# Altium schematic sheet Daemons.SchDoc
size B; DocumentNumber: 1; SheetNumber: 1; SheetTotal: 1
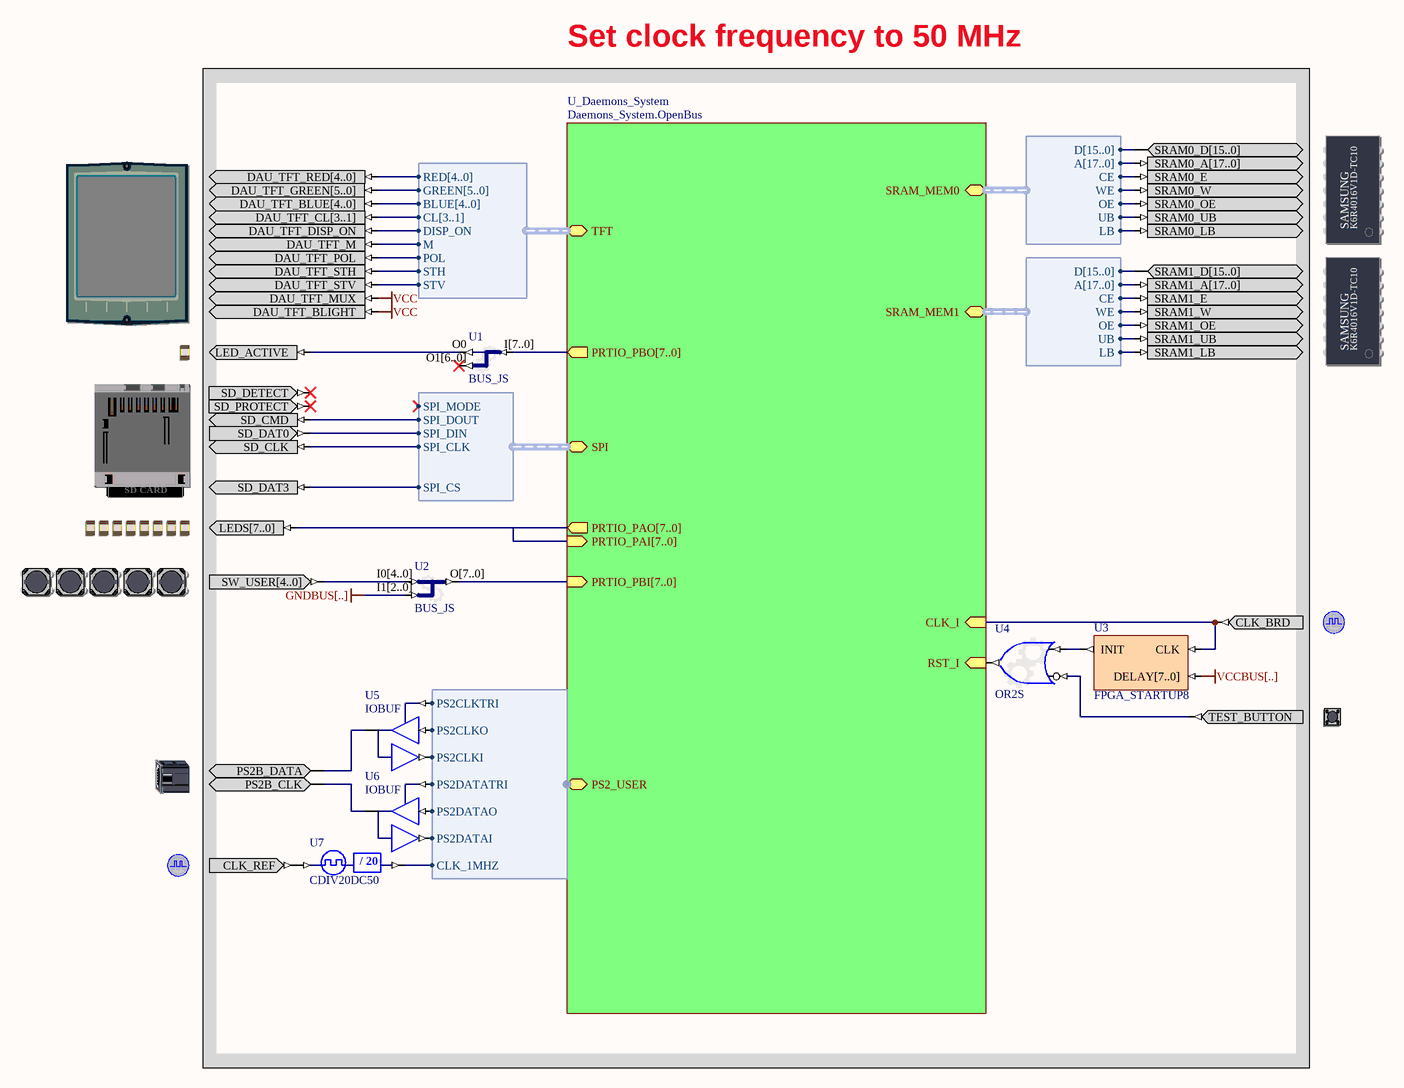
[diagram p0: Daemons.SchDoc]

## Parts
(Parts that share a designator on the sheet are numbered #1, #2 ... from top to bottom, then left to right.)
?#1  SRAM_DAUGHTER0  (value not drawn)
?#2  TFT_LCD  (value not drawn)
?#3  SRAM_DAUGHTER1  (value not drawn)
?#4  LED_ACTIVE  (value not drawn)
?#5  SD_CARD  (value not drawn)
?#6  LED  (value not drawn)
?#7  USER_BUTTONS  (value not drawn)
?#8  CLOCK_BOARD  (value not drawn)
?#9  TEST_BUTTON  (value not drawn)
?#10  PS2B  (value not drawn)
?#11  CLOCK_REFERENCE  (value not drawn)
U1  BUS_JS
U2  BUS_JS
U3  FPGA_STARTUP8
U4  OR2S
U5  IOBUF
U6  IOBUF
U7  CDIV20DC50

## Blocks framed on the sheet
Set clock frequency to 50 MHz: ?#1-?#11 U1-U7

## Sub-sheets
U_Daemons_System = Daemons_System.OpenBus: CLK_I (in), RST_I (in), PRTIO_PAO[7..0] (out), PRTIO_PAI[7..0] (in), PRTIO_PBO[7..0] (out), PRTIO_PBI[7..0] (in), TFT (harness VGA32_TFT), SPI (harness SPI_W), PS2_USER (harness PS2_W), SRAM_MEM0 (harness WB_MEM_CTRL_SRAM16_A18), SRAM_MEM1 (harness WB_MEM_CTRL_SRAM16_A18)

## Harnesses
VGA32_TFT: RED[4..0], GREEN[5..0], BLUE[4..0], CL[3..1], DISP_ON, M, POL, STH, STV
SPI_W: SPI_DOUT, SPI_DIN, SPI_CLK, SPI_MODE, SPI_CS
PS2_W: PS2CLKTRI, PS2CLKO, PS2CLKI, PS2DATATRI, PS2DATAO, PS2DATAI, CLK_1MHZ
WB_MEM_CTRL_SRAM16_A18: D[15..0], A[17..0], CE, WE, OE, UB, LB

## Nets
GNDBUS[..]: U2.I1[2..0]
VCC: ?#2.DAU_TFT_BLIGHT ?#2.DAU_TFT_MUX
VCCBUS[..]: U3.DELAY[7..0]
Net?#1_SRAM0_A[17..0]: ?#1.SRAM0_A[17..0] ; sheet U_Daemons_System/SRAM_MEM0.A[17..0]
Net?#1_SRAM0_D[15..0]: ?#1.SRAM0_D[15..0] ; sheet U_Daemons_System/SRAM_MEM0.D[15..0]
Net?#1_SRAM0_E: ?#1.SRAM0_E ; sheet U_Daemons_System/SRAM_MEM0.CE
Net?#1_SRAM0_LB: ?#1.SRAM0_LB ; sheet U_Daemons_System/SRAM_MEM0.LB
Net?#1_SRAM0_OE: ?#1.SRAM0_OE ; sheet U_Daemons_System/SRAM_MEM0.OE
Net?#1_SRAM0_UB: ?#1.SRAM0_UB ; sheet U_Daemons_System/SRAM_MEM0.UB
Net?#1_SRAM0_W: ?#1.SRAM0_W ; sheet U_Daemons_System/SRAM_MEM0.WE
Net?#2_DAU_TFT_BLUE[4..0]: ?#2.DAU_TFT_BLUE[4..0] ; sheet U_Daemons_System/TFT.BLUE[4..0]
Net?#2_DAU_TFT_CL[3..1]: ?#2.DAU_TFT_CL[3..1] ; sheet U_Daemons_System/TFT.CL[3..1]
Net?#2_DAU_TFT_DISP_ON: ?#2.DAU_TFT_DISP_ON ; sheet U_Daemons_System/TFT.DISP_ON
Net?#2_DAU_TFT_GREEN[5..0]: ?#2.DAU_TFT_GREEN[5..0] ; sheet U_Daemons_System/TFT.GREEN[5..0]
Net?#2_DAU_TFT_M: ?#2.DAU_TFT_M ; sheet U_Daemons_System/TFT.M
Net?#2_DAU_TFT_POL: ?#2.DAU_TFT_POL ; sheet U_Daemons_System/TFT.POL
Net?#2_DAU_TFT_RED[4..0]: ?#2.DAU_TFT_RED[4..0] ; sheet U_Daemons_System/TFT.RED[4..0]
Net?#2_DAU_TFT_STH: ?#2.DAU_TFT_STH ; sheet U_Daemons_System/TFT.STH
Net?#2_DAU_TFT_STV: ?#2.DAU_TFT_STV ; sheet U_Daemons_System/TFT.STV
Net?#3_SRAM1_A[17..0]: ?#3.SRAM1_A[17..0] ; sheet U_Daemons_System/SRAM_MEM1.A[17..0]
Net?#3_SRAM1_D[15..0]: ?#3.SRAM1_D[15..0] ; sheet U_Daemons_System/SRAM_MEM1.D[15..0]
Net?#3_SRAM1_E: ?#3.SRAM1_E ; sheet U_Daemons_System/SRAM_MEM1.CE
Net?#3_SRAM1_LB: ?#3.SRAM1_LB ; sheet U_Daemons_System/SRAM_MEM1.LB
Net?#3_SRAM1_OE: ?#3.SRAM1_OE ; sheet U_Daemons_System/SRAM_MEM1.OE
Net?#3_SRAM1_UB: ?#3.SRAM1_UB ; sheet U_Daemons_System/SRAM_MEM1.UB
Net?#3_SRAM1_W: ?#3.SRAM1_W ; sheet U_Daemons_System/SRAM_MEM1.WE
Net?#4_LED_ACTIVE: ?#4.LED_ACTIVE U1.O0
Net?#5_SD_CLK: ?#5.SD_CLK ; sheet U_Daemons_System/SPI.SPI_CLK
Net?#5_SD_CMD: ?#5.SD_CMD ; sheet U_Daemons_System/SPI.SPI_DOUT
Net?#5_SD_DAT0: ?#5.SD_DAT0 ; sheet U_Daemons_System/SPI.SPI_DIN
Net?#5_SD_DAT3: ?#5.SD_DAT3 ; sheet U_Daemons_System/SPI.SPI_CS
Net?#6_LEDS[7..0]: ?#6.LEDS[7..0] ; sheet U_Daemons_System/PRTIO_PAO[7..0], sheet U_Daemons_System/PRTIO_PAI[7..0]
Net?#7_SW_USER[4..0]: ?#7.SW_USER[4..0] U2.I0[4..0]
Net?#8_CLK_BRD: ?#8.CLK_BRD U3.CLK ; sheet U_Daemons_System/CLK_I
Net?#9_TEST_BUTTON: ?#9.TEST_BUTTON U4.I1
Net?#10_PS2B_CLK: ?#10.PS2B_CLK U6.IO
Net?#10_PS2B_DATA: ?#10.PS2B_DATA U5.IO
Net?#11_CLK_REF: ?#11.CLK_REF U7.CLKIN
NetU1_I[7..0]: U1.I[7..0] ; sheet U_Daemons_System/PRTIO_PBO[7..0]
NetU2_O[7..0]: U2.O[7..0] ; sheet U_Daemons_System/PRTIO_PBI[7..0]
NetU3_INIT: U3.INIT U4.I0
NetU4_O: U4.O ; sheet U_Daemons_System/RST_I
NetU5_I: U5.I ; sheet U_Daemons_System/PS2_USER.PS2CLKO
NetU5_O: U5.O ; sheet U_Daemons_System/PS2_USER.PS2CLKI
NetU5_T: U5.T ; sheet U_Daemons_System/PS2_USER.PS2CLKTRI
NetU6_I: U6.I ; sheet U_Daemons_System/PS2_USER.PS2DATAO
NetU6_O: U6.O ; sheet U_Daemons_System/PS2_USER.PS2DATAI
NetU6_T: U6.T ; sheet U_Daemons_System/PS2_USER.PS2DATATRI
NetU7_CLKDV: U7.CLKDV ; sheet U_Daemons_System/PS2_USER.CLK_1MHZ

Not connected (* = marked no-connect by the designer): ?#5 SD_DETECT* SD_PROTECT*; U1 O1[6..0]*

## Buses and harness runs
bus sheet U_Daemons_System/PRTIO_PAI[7..0] = sheet U_Daemons_System/PRTIO_PAO[7..0]

## Notes on the sheet
- Title
- Size:
- Date:
- B
- Number:
- Time:
- Revision:
- Sheet
- of
- File:
- (in symbol CDIV20DC50) / 20
- (in symbol SD_CARD) SD CARD
- (in symbol SRAM_DAUGHTER0) SAMSUNG; K6R4016V1D-TC10
- (in symbol SRAM_DAUGHTER1) SAMSUNG; K6R4016V1D-TC10

## Library data of the parts
?#1 = SRAM_DAUGHTER0: Free Static RAM - Daughterboard; PortComponent: True; Published: 14-May-2007; Publisher: Altium Limited; HelpURL: TR0143 NanoBoard Technical Reference Manual - NB2.pdf#page=24
?#2 = TFT_LCD: TFT LCD Panel; PortComponent: True; Published: 22-Jan-2007; Publisher: Altium Limited; HelpURL: TR0143 Technical Reference Manual for Altium's Desktop NanoBoard NB2DSK01.pdf#page=50
?#3 = SRAM_DAUGHTER1: Free Static RAM - Daughterboard; PortComponent: True; Published: 14-May-2007; Publisher: Altium Limited; HelpURL: TR0143 NanoBoard Technical Reference Manual - NB2.pdf#page=24
?#4 = LED_ACTIVE: LED; PortComponent: True; Published: 14-May-2007; Publisher: Altium Limited; HelpURL: TR0146 Technical Reference for Altium's Mass Storage Peripheral Board PB02.pdf#page=9
?#5 = SD_CARD: Secure Digital Card Socket; PortComponent: True; Published: 22-Jan-2007; Publisher: Altium Limited; UseInDSF: True; HelpURL: TR0146 Technical Reference for Altium's Mass Storage Peripheral Board PB02.pdf#page=7
?#6 = LED: Bank of eight Red LEDs; PortComponent: True; Published: 19-Nov-2003; Publisher: Altium Limited; HelpURL: TR0143 NanoBoard Technical Reference Manual - NB2.pdf#page=45
?#7 = USER_BUTTONS: Generic User Buttons; PortComponent: True; Published: 16-Apr-2007; Publisher: Altium Limited; HelpURL: TR0143 Technical Reference Manual for Altium's Desktop NanoBoard NB2DSK01.pdf#page=53
?#8 = CLOCK_BOARD: Global System Clock Supply; PortComponent: True; Published: 19-Nov-2003; Publisher: Altium Limited; HelpURL: TR0143 Technical Reference Manual for Altium's Desktop NanoBoard NB2DSK01.pdf#page=41; UseInDSF: True
?#9 = TEST_BUTTON: Test / Reset Button; PortComponent: True; Published: 19-Nov-2003; Publisher: Altium Limited; HelpURL: TR0143 Technical Reference Manual for Altium's Desktop NanoBoard NB2DSK01.pdf#page=53
?#10 = PS2B: Key Board PS2 Connector; PortComponent: True; Published: 19-Nov-2003; Publisher: Altium Limited; HelpURL: TR0143 Technical Reference Manual for Altium's Desktop NanoBoard NB2DSK01.pdf#page=46
?#11 = CLOCK_REFERENCE: Global System Clock Reference Supply; PortComponent: True; Published: 19-Nov-2003; Publisher: Altium Limited; HelpURL: TR0143 Technical Reference Manual for Altium's Desktop NanoBoard NB2DSK01.pdf#page=41
U1 = BUS_JS: Configurable Bus Joiner/Splitter; ConfiguratorName: GENERIC_BUS_JS; ConfigurationParameters: {}Version[1.0]{}SplitterJoinerType[Splitter]{}SignalCount[2]{}SignalWidth0[1]{}SignalWidth1[7]{}; LastRevisionNo: 1.00.00; Published: 17-Sep-2008; Publisher: Altium Limited
U2 = BUS_JS: Configurable Bus Joiner/Splitter; ConfiguratorName: GENERIC_BUS_JS; ConfigurationParameters: {}Version[1.0]{}SplitterJoinerType[Joiner]{}SignalCount[2]{}SignalWidth0[5]{}SignalWidth1[3]{}; LastRevisionNo: 1.00.00; Published: 17-Sep-2008; Publisher: Altium Limited
U3 = FPGA_STARTUP8: FPGA Startup With 8 Bit Delay; Published: 9-Dec-2004; Publisher: Altium Limited; HelpURL: CR0119 FPGA_STARTUPx Powerup Delay Unit.pdf; LastRevisionNo: 1.00.00; ComponentLink1Description: Core &Resource Usage; ComponentLink1URL: CR0139 FPGA Peripheral Resource Usage.pdf#page=11
U4 = GATE: Configurable Generic Gate; ConfiguratorName: GENERIC_GATE; ConfigurationParameters: {}Version[1.0]{}GateKind[OR]{}BusInput[False]{}GateInputType[Bit]{}GateOutputOption[Normal]{}BusWidth[8]{}RegisterOutputs[False]{}NegativeClockEdge[False]{}InputCount[2]{}InputInvert0[False]{}InputInvert1[True]{}; LastRevisionNo: 1.00.00; Published: 3-Sep-2008; Publisher: Altium Limited
U5 U6 = IOBUF: Input/Output Buffer; Enable: Low; Control: Common Control T; ArchiveName: GENERIC; VHDLIB_SIM: GENERIC_LIB; Published: 29-Jan-2004; Publisher: Altium Limited; XilinxEquivalent: IOBUF; LastRevisionNo: 1.00.00; HelpURL: CR0118 FPGA Generic Library Guide.pdf#page=292; ComponentLink1URL: CR0125 FPGA Buffer Resource Usage.pdf#page=78; ComponentLink1Description: Core &Resource Usage; FunctionalClass: Buffer; SubClass: IOBUF
U7 = CDIV20DC50: Clock Divider by 20 with 50% Duty Cycle Output; DivisorRate: 20; DutyCycle: 50; ArchiveName: GENERIC; VHDLIB_SIM: GENERIC_LIB; Published: 29-Jan-2004; Publisher: Altium Limited; LastRevisionNo: 1.00.00; HelpURL: CR0118 FPGA Generic Library Guide.pdf#page=143; ComponentLink1URL: CR0127 FPGA Clock Divider Resource Usage.pdf#page=21; ComponentLink1Description: Core &Resource Usage; FunctionalClass: Clock Divider